# EAGLE design PI TOSLINK (EAGLE 9.6.2)
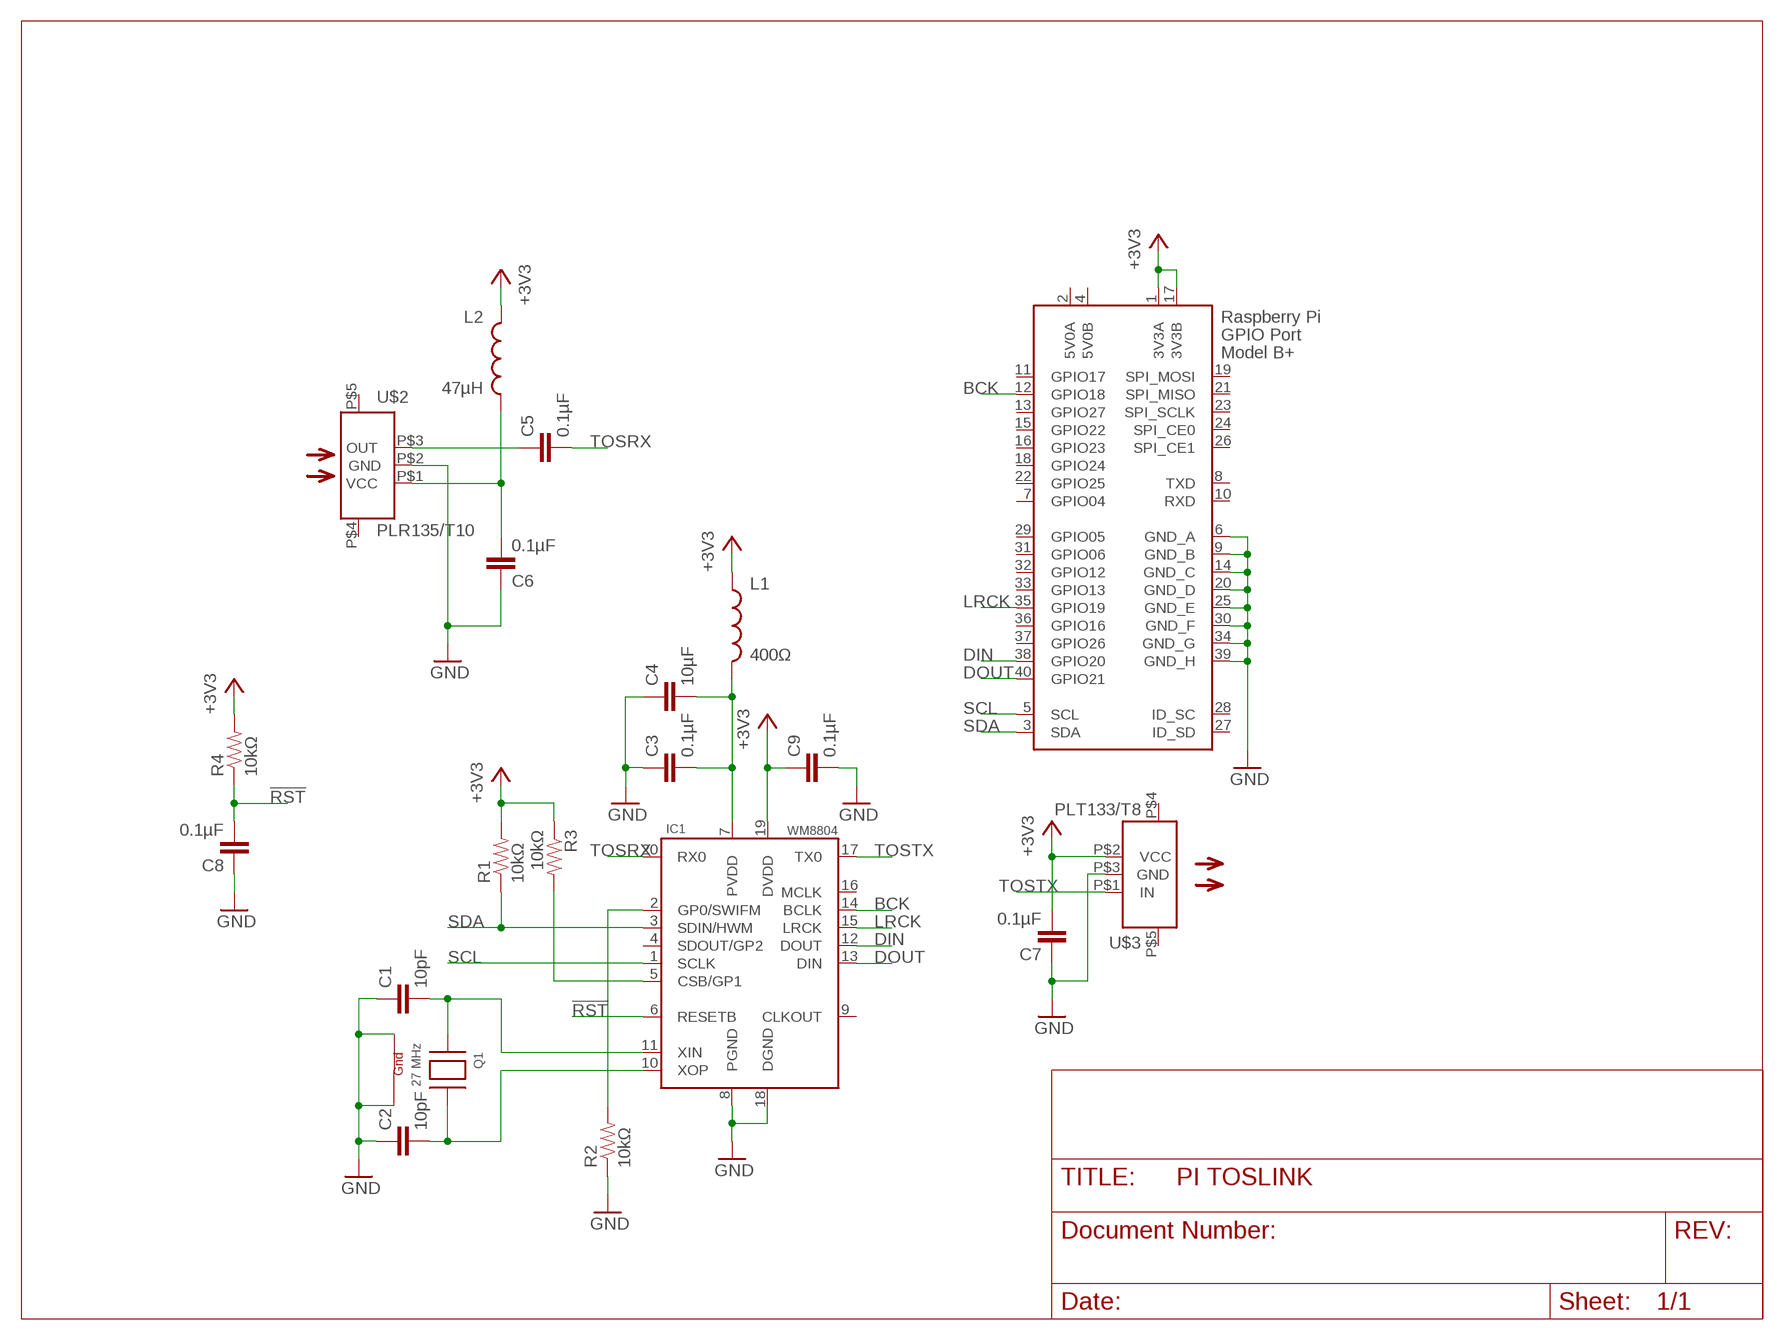
[diagram p0: schematic, sheet 1]

## Parts
C1  10pF  CAP0805  [0805]
C2  10pF  CAP0805  [0805]
C3  0.1µF  CAP0805  [0805]
C4  10µF  CAP0805  [0805]
C5  0.1µF  CAP0805  [0805]
C6  0.1µF  CAP0805  [0805]
C7  0.1µF  CAP0805  [0805]
C8  0.1µF  CAP0805  [0805]
C9  0.1µF  CAP0805  [0805]
IC1  WM8804  [SSOP20BU]
L1  400Ω  INDUCTOR0805  [0805]
L2  47µH  INDUCTOR0805  [0805]
Q1  27 MHz  XTAL-4-3225  [NX3225]
R1  10kΩ  RESISTOR0805-RES  [0805]
R2  10kΩ  RESISTOR0805-RES  [0805]
R3  10kΩ  RESISTOR0805-RES  [0805]
R4  10kΩ  RESISTOR0805-RES  [0805]
U$2  PLR135/T10  [PLR135/T10]
U$3  PLT133/T8  [PLR135/T10]
X1  RASPI_GPIO_B+#_PIN  [RASPI_GPIO_B+_PIN]

## Nets
!RST: C8.2 IC1.6(RESETB) R4.1
+3V3: C7.2 C9.1 IC1.19(DVDD) L1.1 L2.1 R1.2 R3.1 R4.2 U$3.P$2(VCC) X1.1(3V3A) X1.17(3V3B)
BCK: IC1.14(BCLK) X1.12(GPIO18)
DIN: IC1.12(DOUT) X1.38(GPIO20)
DOUT: IC1.13(DIN) X1.40(GPIO21)
GND: C1.1 C2.1 C3.1 C4.1 C6.1 C7.1 C8.1 C9.2 IC1.8(PGND) IC1.18(DGND) Q1.2(G2) Q1.4(G1) R2.1 U$2.P$2(GND) U$3.P$3(GND) X1.6(GND_A) X1.9(GND_B) X1.14(GND_C) X1.20(GND_D) X1.25(GND_E) X1.30(GND_F) X1.34(GND_G) X1.39(GND_H)
LRCK: IC1.15(LRCK) X1.35(GPIO19)
N$1: C2.2 IC1.10(XOP) Q1.3(X2)
N$2: C1.2 IC1.11(XIN) Q1.1(X1)
N$3: C5.1 U$2.P$3(OUT)
N$4: IC1.2(GP0/SWIFM) R2.2
N$6: IC1.5(CSB/GP1) R3.2
N$7: C3.2 C4.2 IC1.7(PVDD) L1.2
N$9: C6.2 L2.2 U$2.P$1(VCC)
SCL: IC1.1(SCLK) X1.5(SCL)
SDA: IC1.3(SDIN/HWM) R1.1 X1.3(SDA)
TOSRX: C5.2 IC1.20(RX0)
TOSTX: IC1.17(TX0) U$3.P$1(IN)
Unconnected: IC1.4(SDOUT/GP2) IC1.9(CLKOUT) IC1.16(MCLK) U$2.P$4(NC) U$2.P$5(NC) U$3.P$4(NC) U$3.P$5(NC) X1.7(GPIO04) X1.8(TXD) X1.10(RXD) X1.11(GPIO17) X1.13(GPIO27) X1.15(GPIO22) X1.16(GPIO23) X1.18(GPIO24) X1.19(SPI_MOSI) X1.21(SPI_MISO) X1.22(GPIO25) X1.23(SPI_SCLK) X1.24(SPI_CE0) X1.26(SPI_CE1) X1.27(ID_SD) X1.28(ID_SC) X1.29(GPIO05) X1.31(GPIO06) X1.32(GPIO12) X1.33(GPIO13) X1.36(GPIO16) X1.37(GPIO26)

## Power pins joined to a net without a drawn wire
5V0A: X1.2(5V0A)
5V0B: X1.4(5V0B)

## Library data of the parts
C1-C9 = SparkFun-Capacitors:CAP: Capacitor Standard 0603 ceramic capacitor, and 0.1" leaded capacitor.
IC1 = AD849x:WM8804
L1 L2 = SparkFun-Passives:INDUCTOR: Inductors Basic Inductor/Choke - 0603 and 1206. Footprints are not proven and vary greatly between part numbers. SRN6045- 33uH, 20% 1.4A
Q1 = adafruit:XTAL-4: Classic 4-pin 3.2 x 2.5mm crystal
R1-R4 = SparkFun-Resistors:RESISTOR: Resistor Basic schematic elements and footprints for 0603, 1206, and PTH resistors.
U$2 = toshiba:PLR135/T10
U$3 = toshiba:PLT133/T8
X1 = raspberrypi_bastelstube_v13:RASPI_GPIO_B+#: 2x20 header connector, all pins connected

## Board
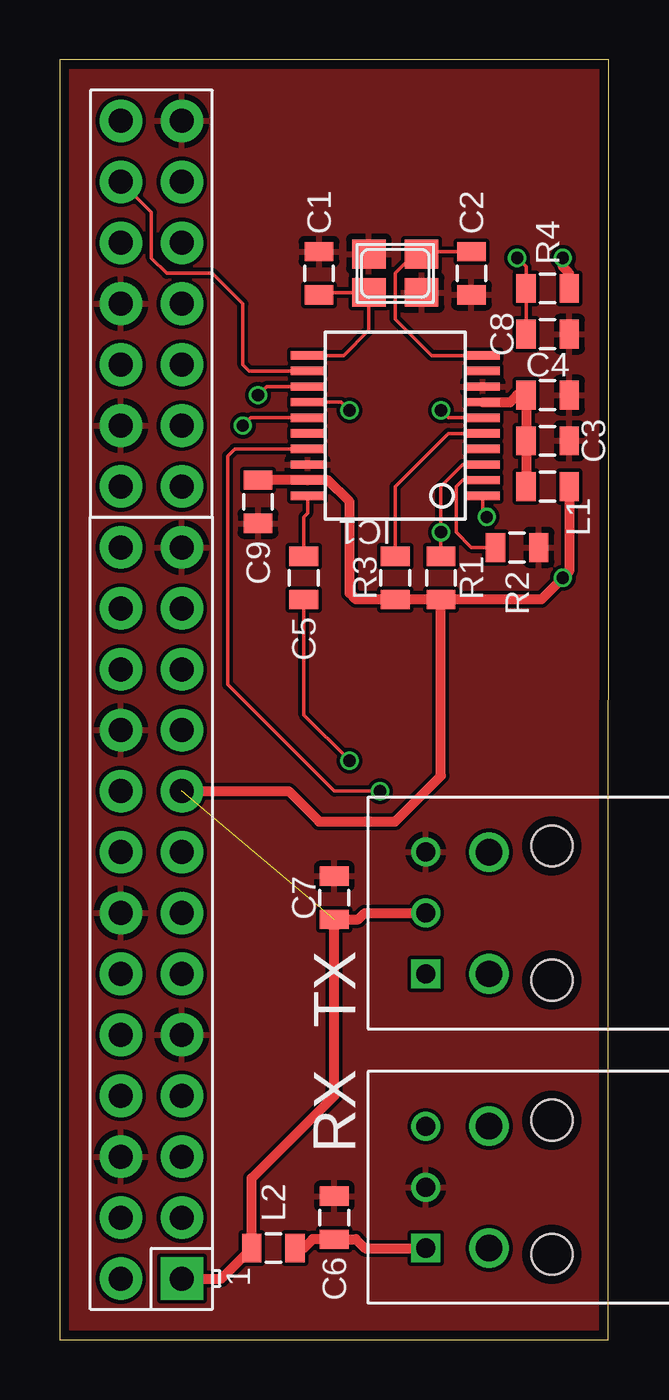
[diagram p1: board, top side]
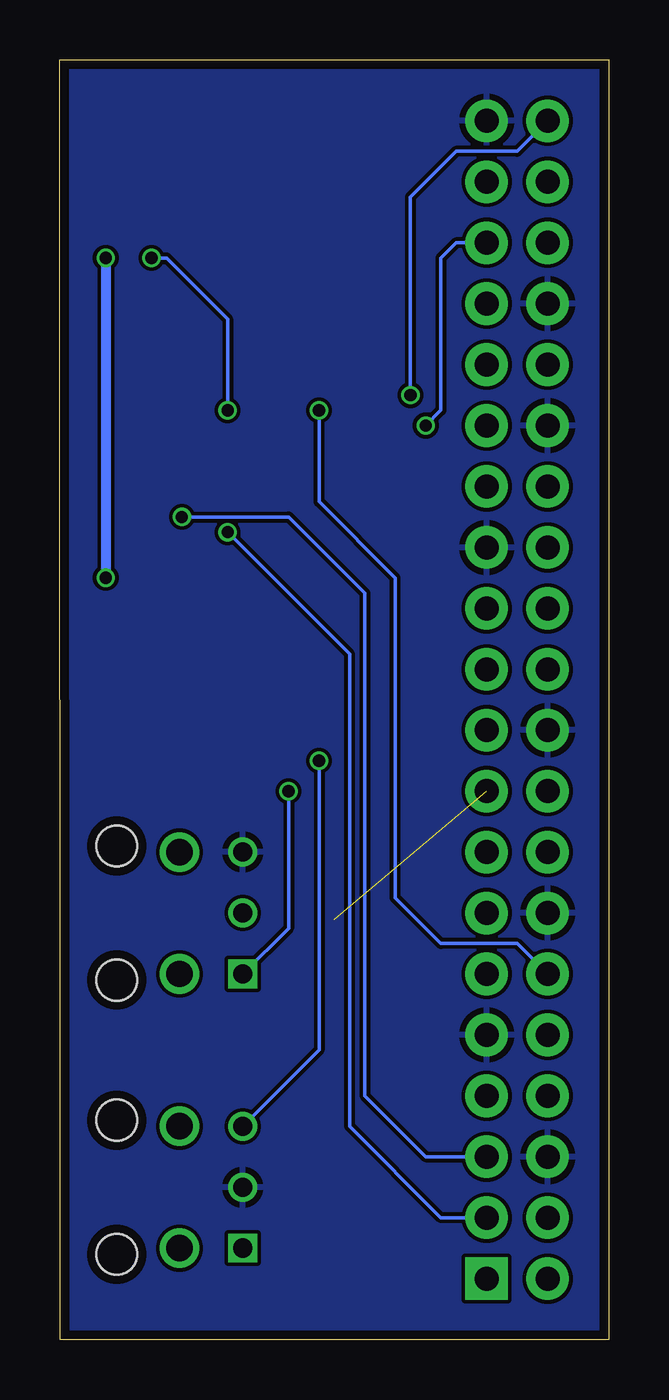
[diagram p2: board, bottom side, seen from below]

Size 22.86 x 53.34 mm. Coordinates in mm from the lower left corner, seen from the top.
Outline: 0,0 22.84,0 22.86,53.34 0,53.34 0,0
Copper layers (1*16): Top 0.035559375mm / dielectric 1.6mm / Bottom 0.035559375mm
Design rules "oshpark-2layer": minimum track width 6mil, minimum drill 10mil, track to track 6mil, track to pad 6mil, pad to pad 6mil, via to via 6mil, smd to smd 6mil, copper to edge 15mil, drill to drill 6mil, minimum pad ring 5mil, minimum via ring 5mil, stop-mask expansion 2.5mil, vias tented up to drill 20mil, thermal gap 10mil

### Footprints (pad centres in the part's own frame; a part is rotated, then mirrored left to right if it is on the bottom)
0805 = smd 0.8 x 1.2: 1 -0.9,0; 2 0.9,0
SSOP20BU = smd 0.348 x 1.397: 1 -2.925,-3.656; 2 -2.275,-3.656; 3 -1.625,-3.656; 4 -0.975,-3.656; 5 -0.325,-3.656; 6 0.325,-3.656; 7 0.975,-3.656; 8 1.625,-3.656; 9 2.275,-3.656; 10 2.925,-3.656; 11 2.925,3.656; 12 2.275,3.656; 13 1.625,3.656; 14 0.975,3.656; 15 0.325,3.656; 16 -0.325,3.656; 17 -0.975,3.656; 18 -1.625,3.656; 19 -2.275,3.656; 20 -2.925,3.656
NX3225 = smd 1.4 x 1.2: 1 -1.1,-0.8; 2 1.1,-0.8; 3 1.1,0.8; 4 -1.1,0.8
PLR135/T10 = drill 0.8 square: P$1 2.54,-2.54 | drill 0.8: P$2 0,-2.54; P$3 -2.54,-2.54 | drill 1.1: P$4 -2.54,0.102; P$5 2.54,0.102 | hole 1.702: -2.794,2.718; 2.794,2.718
RASPI_GPIO_B+_PIN = drill 1 pad 1.778 square: 1 -24.13,-1.27 | drill 1 pad 1.778: 2 -24.13,1.27; 3 -21.59,-1.27; 4 -21.59,1.27; 5 -19.05,-1.27; 6 -19.05,1.27; 7 -16.51,-1.27; 8 -16.51,1.27; 9 -13.97,-1.27; 10 -13.97,1.27; 11 -11.43,-1.27; 12 -11.43,1.27; 13 -8.89,-1.27; 14 -8.89,1.27; 15 -6.35,-1.27; 16 -6.35,1.27; 17 -3.81,-1.27; 18 -3.81,1.27; 19 -1.27,-1.27; 20 -1.27,1.27; 21 1.27,-1.27; 22 1.27,1.27; 23 3.81,-1.27; 24 3.81,1.27; 25 6.35,-1.27; 26 6.35,1.27; 27 8.89,-1.27; 28 8.89,1.27; 29 11.43,-1.27; 30 11.43,1.27; 31 13.97,-1.27; 32 13.97,1.27; 33 16.51,-1.27; 34 16.51,1.27; 35 19.05,-1.27; 36 19.05,1.27; 37 21.59,-1.27; 38 21.59,1.27; 39 24.13,-1.27; 40 24.13,1.27

### Placement (x,y rotation side)
C1  10.79,44.45 270 top
C2  17.14,44.45 90 top
C3  20.32,37.47 180 top
C4  20.32,39.37 180 top
C5  10.16,31.75 90 top
C6  11.43,5.08 270 top
C7  11.43,18.41 270 top
C8  20.32,41.91 180 top
C9  8.26,34.92 270 top
IC1  13.97,38.1 90 top
L1  20.32,35.56 180 top
L2  8.89,3.81 0 top
Q1  13.97,44.45 0 top
R1  15.88,31.75 270 top
R2  19.05,33.02 180 top
R3  13.97,31.75 90 top
R4  20.32,43.81 0 top
U$2  17.78,6.35 270 top
U$3  17.78,17.78 270 top
X1  3.81,26.67 90 top

### Tracks (layer width: path | path; a pad name or v marks a point on that pad's centre or on a via)
!RST  (via drill 0.51)
  Top 0.152: C8.2 R4.1 19.42,44.72 v19.05,45.09 | IC1.6 16.18,38.42 v15.88,38.73
  Bottom 0.152: v19.05,45.09 18.41,45.09 15.88,42.55 v15.88,38.73
+3V3  (via drill 0.51)  (1 unrouted)
  Top 0.406: X1.1 6.72,2.54 L2.1 7.99,6.72 11.43,10.16 C7.2 12.44,17.52 12.7,17.78 U$3.P$2 | X1.17 9.53,22.86 10.79,21.59 13.97,21.59 15.88,23.5 R1.2 | R1.2 R3.1 12.33,30.85 12.06,31.11 12.06,33.02 12.06,34.92 11.16,35.83 IC1.19 C9.1 | R1.2 20.05,30.85 v20.95,31.75 21.22,32.02 L1.1 | R4.2 21.22,44.45 20.95,44.72 v20.95,45.09
  Bottom 0.406: v20.95,45.09 v20.95,31.75
BCK  (via drill 0.51)
  Top 0.152: IC1.14 11.72,39.08 v12.06,38.73
  Bottom 0.152: X1.12 3.81,16.51 6.99,16.51 8.89,18.41 8.89,31.75 12.06,34.92 v12.06,38.73
DIN
  Top 0.152: IC1.12 7.88,40.38 7.62,40.64 7.62,43.18 6.35,44.45 4.45,44.45 3.81,45.09 3.81,46.99 X1.38
DOUT  (via drill 0.51)
  Top 0.152: IC1.13 8.61,39.73 v8.26,39.37
  Bottom 0.152: X1.40 3.81,49.53 6.35,49.53 8.26,47.62 v8.26,39.37
GND
  pour Top: 0,0 0,53.34 22.86,53.34 22.86,0
  pour Bottom: 0,0 0,53.34 22.86,53.34 22.86,0
LRCK  (via drill 0.51)
  Top 0.152: IC1.15 7.95,38.42 v7.62,38.1
  Bottom 0.152: X1.35 6.35,45.72 6.99,45.09 6.99,38.73 v7.62,38.1
N$1
  Top 0.152: C2.2 15.17,45.35 Q1.3 14.77,45.25 13.97,44.45 13.97,42.55 15.49,41.02 IC1.10
N$2
  Top 0.152: C1.2 10.89,43.65 Q1.1 12.87,42.08 11.81,41.02 IC1.11
N$3  (via drill 0.51)
  Top 0.152: v12.06,24.13 10.16,26.04 C5.1
  Bottom 0.152: U$2.P$3 12.06,12.06 v12.06,24.13
N$4
  Top 0.152: IC1.2 16.77,35.83 16.51,35.56 16.51,33.66 17.14,33.02 R2.2
N$6
  Top 0.152: R3.2 13.97,35.56 16.18,37.77 IC1.5
N$7
  Top 0.406: L1.2 C3.2 C4.2 19.05,39.37 18.75,39.08 IC1.7
N$9
  Top 0.406: L2.2 10.16,3.81 10.53,4.18 C6.2 12.33,4.18 12.7,3.81 U$2.P$1
SCL  (via drill 0.51)
  Top 0.152: IC1.1 17.63,34.44 v17.78,34.29
  Bottom 0.152: X1.5 7.62,7.62 10.16,10.16 10.16,31.11 13.34,34.29 v17.78,34.29
SDA  (via drill 0.51)
  Top 0.152: R1.1 v15.88,33.66 15.88,35.56 16.79,36.48 IC1.3
  Bottom 0.152: X1.3 6.99,5.08 10.79,8.89 10.79,28.57 v15.88,33.66
TOSRX
  Top 0.152: IC1.20 10.31,34.44 10.16,34.29 C5.2
TOSTX  (via drill 0.51)
  Top 0.152: IC1.17 7.28,37.12 6.99,36.83 6.99,27.3 11.43,22.86 v13.34,22.86
  Bottom 0.152: U$3.P$1 13.34,17.14 v13.34,22.86

### Text on the board
tNames: TX | RX